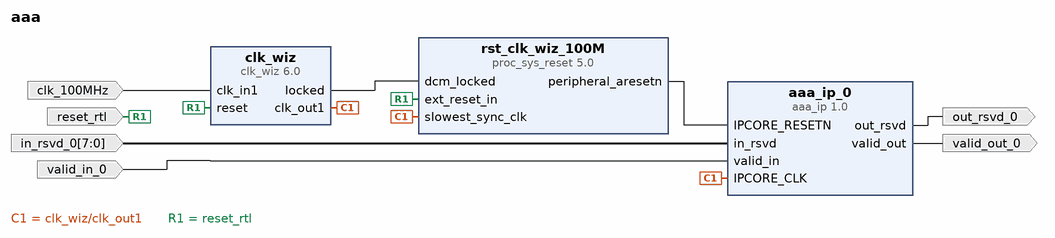
[diagram p0: block diagram of the top level]
# Vivado block design aaa, xc7z010clg400-1, Vivado 2023.2
create_bd_design aaa

create_bd_port -dir I -from 7 -to 0 in_rsvd_0
create_bd_port -dir O out_rsvd_0
create_bd_port -dir I valid_in_0
create_bd_port -dir O valid_out_0
create_bd_port -dir I -type clk clk_100MHz
set_property -dict {CONFIG.FREQ_HZ 100000000} [get_bd_ports clk_100MHz]
create_bd_port -dir I -type rst reset_rtl
set_property -dict {CONFIG.POLARITY ACTIVE_HIGH} [get_bd_ports reset_rtl]

create_bd_cell -type ip -vlnv user.org:ip:aaa_ip:1.0 aaa_ip_0
create_bd_cell -type ip -vlnv xilinx.com:ip:clk_wiz:6.0 clk_wiz
create_bd_cell -type ip -vlnv xilinx.com:ip:proc_sys_reset:5.0 rst_clk_wiz_100M

# ---- connections ----

connect_bd_net [get_bd_pins aaa_ip_0/out_rsvd] [get_bd_ports out_rsvd_0]
connect_bd_net [get_bd_pins aaa_ip_0/valid_out] [get_bd_ports valid_out_0]
connect_bd_net [get_bd_ports clk_100MHz] [get_bd_pins clk_wiz/clk_in1]
connect_bd_net [get_bd_pins clk_wiz/clk_out1] [get_bd_pins aaa_ip_0/IPCORE_CLK] [get_bd_pins rst_clk_wiz_100M/slowest_sync_clk]
connect_bd_net [get_bd_pins clk_wiz/locked] [get_bd_pins rst_clk_wiz_100M/dcm_locked]
connect_bd_net -net in_rsvd_0_1 [get_bd_ports in_rsvd_0] [get_bd_pins aaa_ip_0/in_rsvd]
connect_bd_net [get_bd_ports reset_rtl] [get_bd_pins clk_wiz/reset] [get_bd_pins rst_clk_wiz_100M/ext_reset_in]
connect_bd_net [get_bd_pins rst_clk_wiz_100M/peripheral_aresetn] [get_bd_pins aaa_ip_0/IPCORE_RESETN]
connect_bd_net -net valid_in_0_1 [get_bd_ports valid_in_0] [get_bd_pins aaa_ip_0/valid_in]

validate_bd_design
save_bd_design
